# EAGLE schematic robot_board (EAGLE 6.5.0)
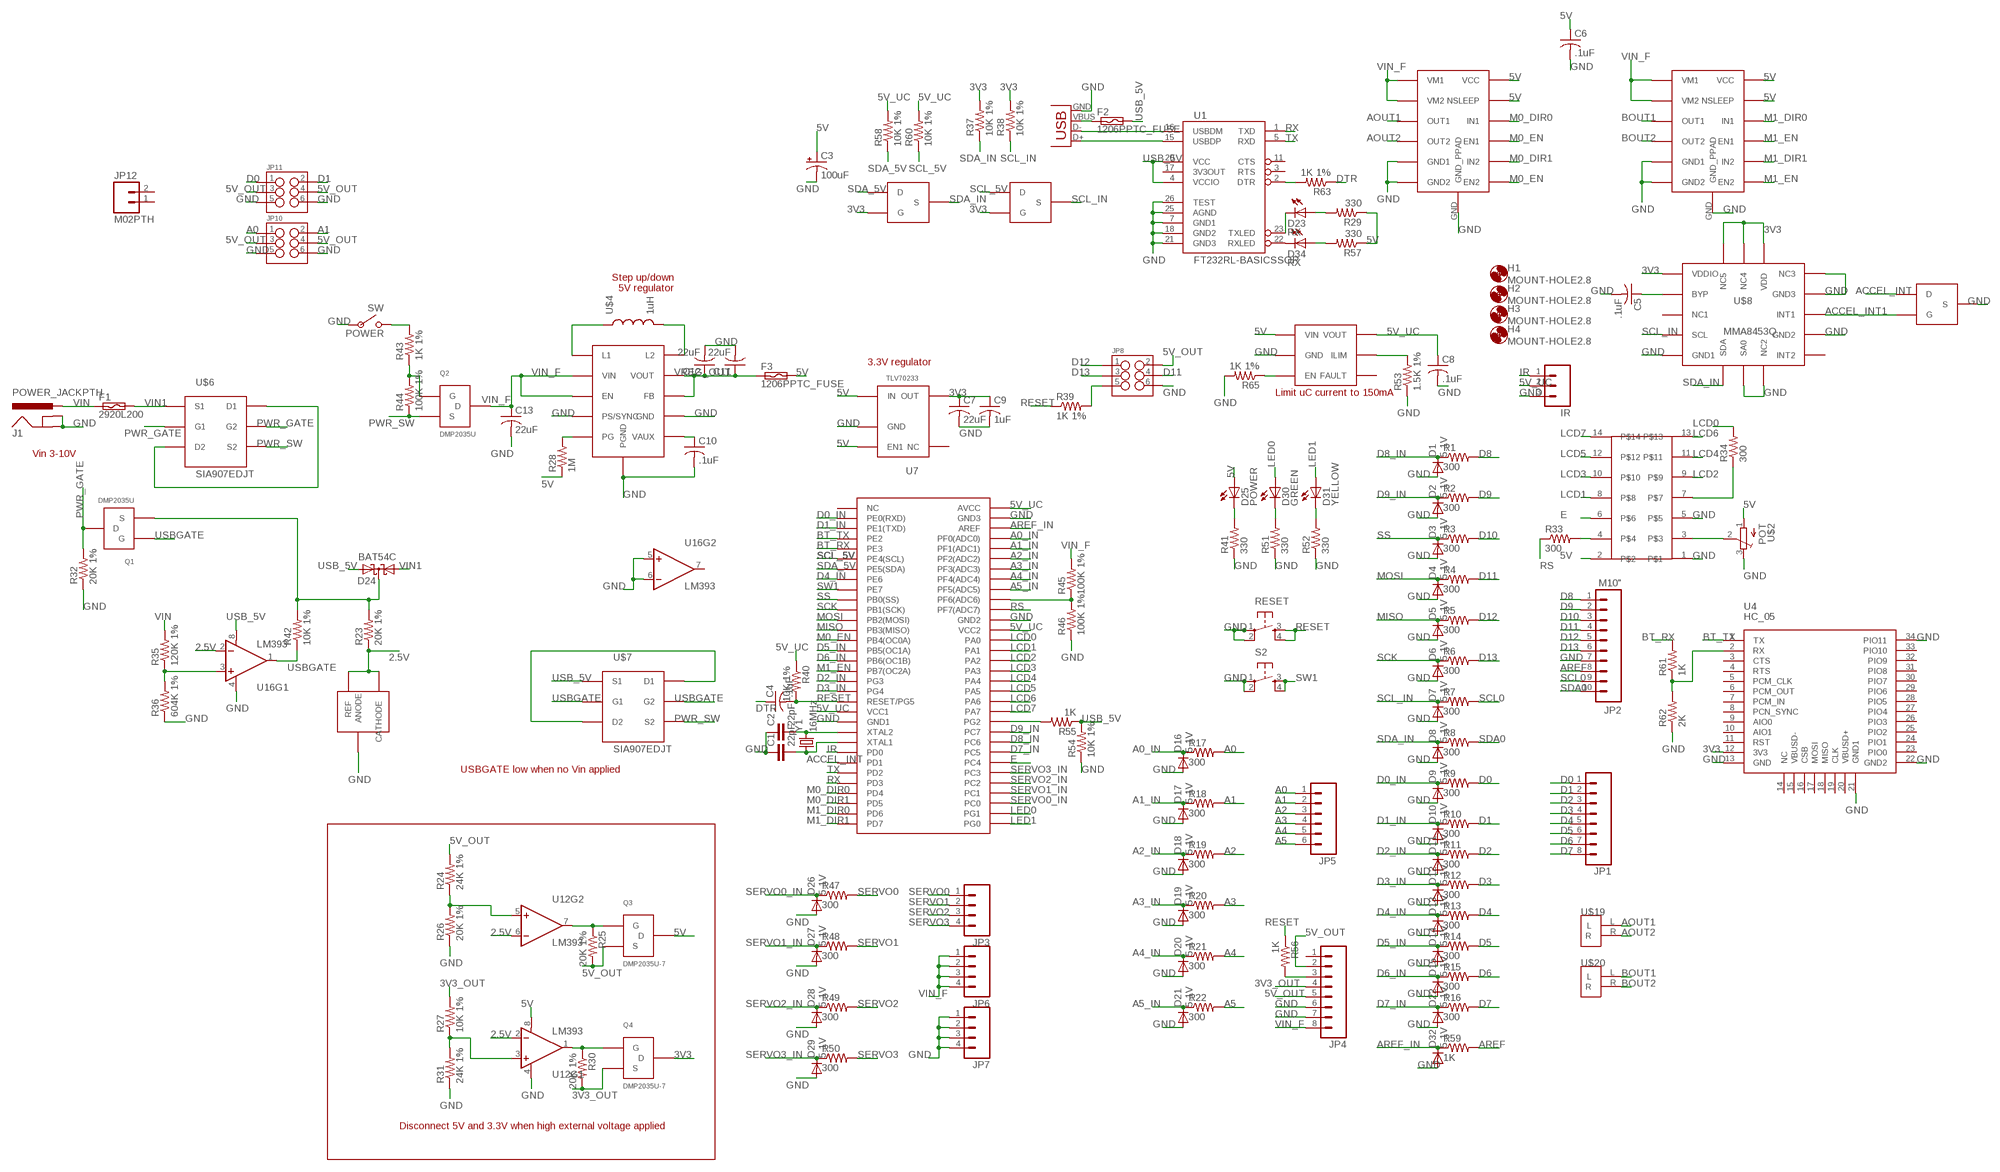
[diagram p0: schematic, sheet 1]

## Parts
C1  22pF  CAP0805  [0805]
C2  22pF  CAP0805  [0805]
C3  100uF  CAP_POLD  [PANASONIC_D]
C4  .1uF  C-USC1206  [C1206]
C5  .1uF  C-USC1206  [C1206]
C6  .1uF  C-USC1206  [C1206]
C7  22uF  C-USC1206  [C1206]
C8  .1uF  C-USC1206  [C1206]
C9  1uF  C-USC1206  [C1206]
C10  .1uF  C-USC1206  [C1206]
C11  22uF  C-USC1206  [C1206]
C12  22uF  C-USC1206  [C1206]
C13  22uF  C-USC1206  [C1206]
D1  5.1V  DIODESOT23  [SOT23-3]
D2  5.1V  DIODESOT23  [SOT23-3]
D3  5.1V  DIODESOT23  [SOT23-3]
D4  5.1V  DIODESOT23  [SOT23-3]
D5  5.1V  DIODESOT23  [SOT23-3]
D6  5.1V  DIODESOT23  [SOT23-3]
D7  5.1V  DIODESOT23  [SOT23-3]
D8  5.1V  DIODESOT23  [SOT23-3]
D9  5.1V  DIODESOT23  [SOT23-3]
D10  5.1V  DIODESOT23  [SOT23-3]
D11  5.1V  DIODESOT23  [SOT23-3]
D12  5.1V  DIODESOT23  [SOT23-3]
D13  5.1V  DIODESOT23  [SOT23-3]
D14  5.1V  DIODESOT23  [SOT23-3]
D15  5.1V  DIODESOT23  [SOT23-3]
D16  5.1V  DIODESOT23  [SOT23-3]
D17  5.1V  DIODESOT23  [SOT23-3]
D18  5.1V  DIODESOT23  [SOT23-3]
D19  5.1V  DIODESOT23  [SOT23-3]
D20  5.1V  DIODESOT23  [SOT23-3]
D21  5.1V  DIODESOT23  [SOT23-3]
D22  5.1V  DIODESOT23  [SOT23-3]
D23  RX  LED-GREENLILYPAD  [LED-1206]
D24  BAT54C  [SOT23]
D25  POWER  LED-GREENLILYPAD  [LED-1206]
D26  5.1V  DIODESOT23  [SOT23-3]
D27  5.1V  DIODESOT23  [SOT23-3]
D28  5.1V  DIODESOT23  [SOT23-3]
D29  5.1V  DIODESOT23  [SOT23-3]
D30  GREEN  LED-GREENLILYPAD  [LED-1206]
D31  YELLOW  LED-GREENLILYPAD  [LED-1206]
D32  5.1V  DIODESOT23  [SOT23-3]
D34  RX  LED-GREENLILYPAD  [LED-1206]
F1  2920L200  [SMD050F]
F2  1206PPTC_FUSE  [R1206]
F3  1206PPTC_FUSE  [R1206]
H1  MOUNT-HOLE2.8  [2,8]
H2  MOUNT-HOLE2.8  [2,8]
H3  MOUNT-HOLE2.8  [2,8]
H4  MOUNT-HOLE2.8  [2,8]
IR  M03PTH  [1X03]
J1  POWER_JACKPTH  [POWER_JACK_PTH]
JP1  M081X08  [1X08]
JP2  M10"  [1X10]
JP3  M04PTH  [1X04]
JP4  M081X08  [1X08]
JP5  M06SIP  [1X06]
JP6  M04PTH  [1X04]
JP7  M04PTH  [1X04]
JP8  M03X22X3_SILK_SM  [2X3]
JP9  USB-B  USBPTH  [USB-B-PTH]
JP10  M03X22X3_SILK_SM  [2X3]
JP11  M03X22X3_SILK_SM  [2X3]
JP12  M02PTH  [1X02]
POWER  SW  [SW]
Q1  DMP2035U  [SOT23]
Q2  DMP2035U  [SOT23]
Q3  DMP2035U-7  [SOT23@1]
Q4  DMP2035U-7  [SOT23@1]
R1  300  R-US_R1206  [R1206]
R2  300  R-US_R1206  [R1206]
R3  300  R-US_R1206  [R1206]
R4  300  R-US_R1206  [R1206]
R5  300  R-US_R1206  [R1206]
R6  300  R-US_R1206  [R1206]
R7  300  R-US_R1206  [R1206]
R8  300  R-US_R1206  [R1206]
R9  300  R-US_R1206  [R1206]
R10  300  R-US_R1206  [R1206]
R11  300  R-US_R1206  [R1206]
R12  300  R-US_R1206  [R1206]
R13  300  R-US_R1206  [R1206]
R14  300  R-US_R1206  [R1206]
R15  300  R-US_R1206  [R1206]
R16  300  R-US_R1206  [R1206]
R17  300  R-US_R1206  [R1206]
R18  300  R-US_R1206  [R1206]
R19  300  R-US_R1206  [R1206]
R20  300  R-US_R1206  [R1206]
R21  300  R-US_R1206  [R1206]
R22  300  R-US_R1206  [R1206]
R23  20K 1%  R-US_R1206  [R1206]
R24  24K 1%  R-US_R1206  [R1206]
R25  20K 1%  R-US_R1206  [R1206]
R26  20K 1%  R-US_R1206  [R1206]
R27  10K 1%  R-US_R1206  [R1206]
R28  1M  R-US_R1206  [R1206]
R29  330  R-US_R1206  [R1206]
R30  20K 1%  R-US_R1206  [R1206]
R31  24K 1%  R-US_R1206  [R1206]
R32  20K 1%  R-US_R1206  [R1206]
R33  300  R-US_R1206  [R1206]
R34  300  R-US_R1206  [R1206]
R35  120K 1%  R-US_R1206  [R1206]
R36  604K 1%  R-US_R1206  [R1206]
R37  10K 1%  R-US_R1206  [R1206]
R38  10K 1%  R-US_R1206  [R1206]
R39  1K 1%  R-US_R1206  [R1206]
R40  10K 1%  R-US_R1206  [R1206]
R41  330  R-US_R1206  [R1206]
R42  10K 1%  R-US_R1206  [R1206]
R43  1K 1%  R-US_R1206  [R1206]
R44  100K 1%  R-US_R1206  [R1206]
R45  100K 1%  R-US_R1206  [R1206]
R46  100K 1%  R-US_R1206  [R1206]
R47  300  R-US_R1206  [R1206]
R48  300  R-US_R1206  [R1206]
R49  300  R-US_R1206  [R1206]
R50  300  R-US_R1206  [R1206]
R51  330  R-US_R1206  [R1206]
R52  330  R-US_R1206  [R1206]
R53  1.5K 1%  R-US_R1206  [R1206]
R54  10K 1%  R-US_R1206  [R1206]
R55  1K  R-US_R1206  [R1206]
R56  1K  R-US_R1206  [R1206]
R57  330  R-US_R1206  [R1206]
R58  10K 1%  R-US_R1206  [R1206]
R59  1K  R-US_R1206  [R1206]
R60  10K 1%  R-US_R1206  [R1206]
R61  1K  R-US_R1206  [R1206]
R62  2K  R-US_R1206  [R1206]
R63  1K 1%  R-US_R1206  [R1206]
R65  1K 1%  R-US_R1206  [R1206]
RESET  TAC_SWITCHPTH  [TACTILE-PTH]
S2  TAC_SWITCHPTH  [TACTILE-PTH]
U1  FT232RL-BASICSSOP  [SSOP28DB]
U4  HC_05  [BLUETOOTH_SMD]
U7  TLV70233  [SOT-23-5]
U8  MIC2009A  [SOT23-M5]
U9  DRV8839  [PWSON-N12]
U10  DRV8839  [PWSON-N12]
U12  LM393  [SO08]
U16  LM393  [SO08]
U17  ATMEGA325PA  [TQFP64]
U$1  2X7HEADER  [2X7]
U$2  POT  [POT]
U$3  TPS63061  [WSON-10]
U$4  1uH  TAIYO4012  [TAIYO4012]
U$5  AP431SAG-7  [SOT23]
U$6  SIA907EDJT  [SC70T]
U$7  SIA907EDJT  [SC70T]
U$8  MMA8453Q  [QFN-COL]
U$9  BSS138  [SOT23]
U$10  BSS138  [SOT23]
U$11  BSS138  [SOT23]
U$19  2POS_TERMINAL  [2POS_TERMINAL]
U$20  2POS_TERMINAL  [2POS_TERMINAL]
Y1  16MHz  CRYSTAL10.5X4.8  [CRYSTAL-SMD-10.5X4.8-2PIN]

## Nets
2.5V: R23.1 U12.2(-IN) U12.6(-IN) U16.2(-IN) U$5.1(CATHODE) U$5.2(REF)
3V3: C7.1 C9.1 Q4.3(D) R37.2 R38.2 U4.12(3V3) U7.P$4(OUT) U$8.P$1(VDDIO) U$8.P$14(VDD) U$8.P$15(NC4) U$8.P$16(NC5) U$9.1(G) U$10.1(G)
3V3_OUT: JP4.4 Q4.2(S) R27.2 R30.2
5V: C3.+ C6.1 D25.A F3.2 Q3.3(D) R28.1 R29.1 R57.1 U7.P$1(IN) U7.P$3(EN1) U8.P$1(VIN) U9.P$7(VCC) U9.P$8(NSLEEP) U10.P$7(VCC) U10.P$8(NSLEEP) U12.8(V+) U$1.2 U$2.1(A)
5V_OUT: JP4.2 JP4.5 JP8.2 JP10.3 JP10.4 JP11.3 JP11.4 Q3.2(S) R24.2 R25.2
5V_UC: C8.1 IR.2 R40.1 R58.2 R60.2 U8.P$6(VOUT) U17.21(VCC1) U17.52(VCC2) U17.64(AVCC)
A0: JP5.1 JP10.1 R17.2
A0_IN: D16.3(C) R17.1 U17.61(PF0(ADC0))
A1: JP5.2 JP10.2 R18.2
A1_IN: D17.3(C) R18.1 U17.60(PF1(ADC1))
A2: JP5.3 R19.2
A2_IN: D18.3(C) R19.1 U17.59(PF2(ADC2))
A3: JP5.4 R20.2
A3_IN: D19.3(C) R20.1 U17.58(PF3(ADC3))
A4: JP5.5 R21.2
A4_IN: D20.3(C) R21.1 U17.57(PF4(ADC4))
A5: JP5.6 R22.2
A5_IN: D21.3(C) R22.1 U17.56(PF5(ADC5))
ACCEL_INT: U17.26(PD1) U$11.3(D)
ACCEL_INT1: U$8.P$11(INT1) U$11.1(G)
AOUT1: U9.P$3(OUT1) U$19.L
AOUT2: U9.P$4(OUT2) U$19.R
AREF: JP2.8 R59.2
AREF_IN: D32.3(C) R59.1 U17.62(AREF)
BOUT1: U10.P$3(OUT1) U$20.L
BOUT2: U10.P$4(OUT2) U$20.R
BT_RX: R61.2 U17.5(PE3)
BT_TX: U4.1(TX) U17.4(PE2)
D0: JP1.1 JP11.1 R9.2
D0_IN: D9.3(C) R9.1 U17.2(PE0(RXD))
D1: JP1.2 JP11.2 R10.2
D1_IN: D10.3(C) R10.1 U17.3(PE1(TXD))
D2: JP1.3 R11.2
D2_IN: D11.3(C) R11.1 U17.18(PG3)
D3: JP1.4 R12.2
D3_IN: D12.3(C) R12.1 U17.19(PG4)
D4: JP1.5 R13.2
D4_IN: D13.3(C) R13.1 U17.8(PE6)
D5: JP1.6 R14.2
D5_IN: D14.3(C) R14.1 U17.15(PB5(OC1A))
D6: JP1.7 R15.2
D6_IN: D15.3(C) R15.1 U17.16(PB6(OC1B))
D7: JP1.8 R16.2
D7_IN: D22.3(C) R16.1 U17.40(PC5)
D8: JP2.1 R1.2
D8_IN: D1.3(C) R1.1 U17.41(PC6)
D9: JP2.2 R2.2
D9_IN: D2.3(C) R2.1 U17.42(PC7)
D10: JP2.3 R3.2
D11: JP2.4 JP8.4 R4.2
D12: JP2.5 JP8.1 R5.2
D13: JP2.6 JP8.3 R6.2
DTR: C4.1 R63.1
E: U17.39(PC4) U$1.6
GND: C1.1 C2.1 C3.- C5.2 C6.2 C7.2 C8.2 C9.2 C10.2 C11.2 C12.2 C13.2 D1.1(A) D2.1(A) D3.1(A) D4.1(A) D5.1(A) D6.1(A) D7.1(A) D8.1(A) D9.1(A) D10.1(A) D11.1(A) D12.1(A) D13.1(A) D14.1(A) D15.1(A) D16.1(A) D17.1(A) D18.1(A) D19.1(A) D20.1(A) D21.1(A) D22.1(A) D26.1(A) D27.1(A) D28.1(A) D29.1(A) D32.1(A) IR.3 J1.GND J1.GNDBREAK JP2.7 JP4.6 JP4.7 JP7.1 JP7.2 JP7.3 JP7.4 JP8.6 JP9.GND JP10.5 JP10.6 JP11.5 JP11.6 POWER.P$2 R26.1 R31.1 R32.1 R36.1 R41.1 R46.1 R51.1 R52.1 R53.1 R54.1 R62.1 R65.2 RESET.1 RESET.2 S2.1 S2.2 U1.7(GND1) U1.18(GND2) U1.21(GND3) U1.25(AGND) U1.26(TEST) U4.13(GND) U4.21(GND1) U4.22(GND2) U4.34(PIO11) U7.P$2(GND) U8.P$2(GND) U9.GND(GND_PPAD) U9.P$5(GND1) U9.P$6(GND2) U10.GND(GND_PPAD) U10.P$5(GND1) U10.P$6(GND2) U12.4(V-) U16.4(V-) U16.5(+IN) U16.6(-IN) U17.22(GND1) U17.53(GND2) U17.63(GND3) U$1.1 U$1.5 U$2.3(E) U$3.GND@N1(PGND) U$3.GND@N2(PGND) U$3.GND@N3(PGND) U$3.GND@N4(PGND) U$3.GND@N5(PGND) U$3.GND@N6(PGND) U$3.GND@N7(PGND) U$3.GND@N8(PGND) U$3.P$4(PS/SYNC) U$3.P$7(GND) U$3.P$11(PGND) U$5.3(ANODE) U$8.P$5(GND1) U$8.P$7(SA0) U$8.P$8(NC2) U$8.P$10(GND2) U$8.P$12(GND3) U$8.P$13(NC3) U$11.2(S)
IR: IR.1 U17.25(PD0)
LCD0: R34.2 U17.51(PA0)
LCD1: U17.50(PA1) U$1.8
LCD2: U17.49(PA2) U$1.9
LCD3: U17.48(PA3) U$1.10
LCD4: U17.47(PA4) U$1.11
LCD5: U17.46(PA5) U$1.12
LCD6: U17.45(PA6) U$1.13
LCD7: U17.44(PA7) U$1.14
LED0: D30.A U17.34(PG1)
LED1: D31.A U17.33(PG0)
M0_DIR0: U9.P$9(IN1) U17.29(PD4)
M0_DIR1: U9.P$11(IN2) U17.30(PD5)
M0_EN: U9.P$10(EN1) U9.P$12(EN2) U17.14(PB4(OC0A))
M1_DIR0: U10.P$9(IN1) U17.31(PD6)
M1_DIR1: U10.P$11(IN2) U17.32(PD7)
M1_EN: U10.P$10(EN1) U10.P$12(EN2) U17.17(PB7(OC2A))
MISO: D5.3(C) R5.1 U17.13(PB3(MISO))
MOSI: D4.3(C) R4.1 U17.12(PB2(MOSI))
N$1: JP9.D- U1.16(USBDM)
N$2: JP9.D+ U1.15(USBDP)
N$3: C2.2 U17.23(XTAL2) Y1.P$2
N$4: C1.2 U17.24(XTAL1) Y1.P$1
N$5: R53.2 U8.P$5(ILIM)
N$6: R55.2 U17.43(PG2)
N$7: JP4.3 R56.2
N$8: C5.1 U$8.P$2(BYP)
N$9: F2.1 JP9.VBUS
N$10: D34.C U1.22(RXLED)
N$11: D34.A R57.2
N$12: D23.A R29.2
N$13: R61.1 R62.2 U4.2(RX)
N$14: R63.2 U1.2(DTR)
N$15: U$1.3 U$2.2(S)
N$16: R28.2 U$3.P$5(PG)
N$17: R65.1 U8.P$3(EN)
N$18: D24.3(CC) Q1.2(S) R23.2 R42.2
N$19: C10.1 U$3.P$6(VAUX)
N$20: U$3.P$1(L1) U$4.P$1
N$21: U$3.P$10(L2) U$4.P$2
N$22: D23.C U1.23(TXLED)
N$23: U$7.D1@1(D1) U$7.D1@2(D1) U$7.D2@1(D2) U$7.D2@2(D2)
N$24: U$6.D1@1(D1) U$6.D1@2(D1) U$6.D2@1(D2) U$6.D2@2(D2)
N$25: R33.2 U$1.4
N$26: R34.1 U$1.7
N$30: Q3.1(G) R25.1 U12.7(OUT)
N$34: R24.1 R26.2 U12.5(+IN)
N$38: R27.1 R31.2 U12.3(+IN)
N$39: R35.1 R36.2 U16.3(+IN)
N$41: D25.C R41.2
N$43: POWER.P$1 R43.2
N$45: Q4.1(G) R30.1 U12.1(OUT)
N$46: JP8.5 R39.2
N$51: Q2.1(G) R43.1 R44.2
N$52: R45.1 R46.2 U17.55(PF6(ADC6))
N$57: D30.C R51.2
N$62: D31.C R52.2
PWR_GATE: Q1.3(D) R32.2 U$6.G1 U$6.G2
PWR_SW: Q2.2(S) R44.1 U$6.S2 U$7.S2
RESET: C4.2 R39.1 R40.2 R56.1 RESET.3 RESET.4 U17.20(RESET/PG5)
RS: R33.1 U17.54(PF7(ADC7))
RX: U1.1(TXD) U17.28(PD3)
SCK: D6.3(C) R6.1 U17.11(PB1(SCK))
SCL0: JP2.9 R7.2
SCL_5V: R60.1 U17.6(PE4(SCL)) U$10.3(D)
SCL_IN: D7.3(C) R7.1 R38.1 U$8.P$4(SCL) U$10.2(S)
SDA0: JP2.10 R8.2
SDA_5V: R58.1 U17.7(PE5(SDA)) U$9.3(D)
SDA_IN: D8.3(C) R8.1 R37.1 U$8.P$6(SDA) U$9.2(S)
SERVO0: JP3.1 R47.2
SERVO0_IN: D26.3(C) R47.1 U17.35(PC0)
SERVO1: JP3.2 R48.2
SERVO1_IN: D27.3(C) R48.1 U17.36(PC1)
SERVO2: JP3.3 R49.2
SERVO2_IN: D28.3(C) R49.1 U17.37(PC2)
SERVO3: JP3.4 R50.2
SERVO3_IN: D29.3(C) R50.1 U17.38(PC3)
SS: D3.3(C) R3.1 U17.10(PB0(SS))
SW1: S2.3 S2.4 U17.9(PE7)
TX: U1.5(RXD) U17.27(PD2)
USB_5V: D24.2(A2) F2.2 R54.2 R55.1 U1.4(VCCIO) U1.20(VCC) U16.8(V+) U$7.S1
USBGATE: Q1.1(G) R42.1 U16.1(OUT) U$7.G1 U$7.G2
VIN: F1.1 J1.PWR R35.2
VIN1: D24.1(A1) F1.2 U$6.S1
VIN_F: C13.1 JP4.8 JP6.1 JP6.2 JP6.3 JP6.4 Q2.3(D) R45.2 U9.P$1(VM1) U9.P$2(VM2) U10.P$1(VM1) U10.P$2(VM2) U$3.P$2(VIN) U$3.P$3(EN)
VREG_OUT: C11.1 C12.1 F3.1 U$3.P$8(FB) U$3.P$9(VOUT)
Unconnected: JP4.1 JP12.1 JP12.2 U1.3(RTS) U1.11(CTS) U1.17(3V3OUT) U4.3(CTS) U4.4(RTS) U4.5(PCM_CLK) U4.6(PCM_OUT) U4.7(PCM_IN) U4.8(PCN_SYNC) U4.9(AIO0) U4.10(AIO1) U4.11(RST) U4.14(NC) U4.15(VBUSD-) U4.16(CSB) U4.17(MOSI) U4.18(MISO) U4.19(CLK) U4.20(VBUSD+) U4.23(PIO0) U4.24(PIO1) U4.25(PIO2) U4.26(PIO3) U4.27(PIO4) U4.28(PIO5) U4.29(PIO6) U4.30(PIO7) U4.31(PIO8) U4.32(PIO9) U4.33(PIO10) U7.P$5(NC) U8.P$4(FAULT) U16.7(OUT) U17.1(NC) U$8.P$3(NC1) U$8.P$9(INT2)

## Notes on the sheet
- Step up/down
  5V regulator
- 3.3V regulator
- Limit uC current to 150mA
- Vin 3-10V
- USBGATE low when no Vin applied
- Disconnect 5V and 3.3V when high external voltage applied

## Library data of the parts
C1 C2 = SparkFun-Passives:CAP: Capacitor Standard 0603 ceramic capacitor, and 0.1" leaded capacitor.
C3 = SparkFun-Capacitors:CAP_POL: Capacitor Polarized These are standard SMD and PTH capacitors. Normally 10uF, 47uF, and 100uF in electrolytic and tantalum varieties. Always verify the external diameter of the through hole cap, it varies with capacity, voltage, and manufacturer. The EIA devices should be standard.
C4-C13 = resistor:C-US: CAPACITOR, American symbol
D1-D22 D26-D29 D32 = SparkFun-DiscreteSemi:DIODE: Diode These are standard reverse protection diodes and small signal diodes. SMA package can handle up to about 1A. SOD-323 can handle about 200mA. What the SOD-323 package when ordering, there are some mfgs out there that are 5-pin packages.
D23 D25 D31 D34 = SparkFun-LED:LED-GREEN: Various green LEDs 0603- DIO-00821 LARGE- DIO-00862 LILYPAD- DIO-09910; PROD_ID: DIO-09910; VALUE: GREEN
D24 = diode:BAT54C: Schottky Diodes Source: Fairchild .. BAT54.pdf
D30 = SparkFun-LED:LED-GREEN: Various green LEDs 0603- DIO-00821 LARGE- DIO-00862 LILYPAD- DIO-09910; PROD_ID: DIO-09910
F1 = jseng:2920L200: PolySwitch (TM) Resettable Device Source: Data sheet <http://www.farnell.com/datasheets/13482.pdf>
F2 F3 = jseng:1206PPTC_FUSE
H1-H4 = holes:MOUNT-HOLE: MOUNTING HOLE with drill center marker
IR = SparkFun-Connectors:M03: Header 3 Standard 3-pin 0.1" header. Use with straight break away headers (SKU : PRT-00116), right angle break away headers (PRT-00553), swiss pins (PRT-00743), machine pins (PRT-00117), and female headers (PRT-00115). Molex polarized connector foot print use with SKU : PRT-08232 with associated crimp pins and housings.
J1 = SparkFun-Connectors:POWER_JACK: Power Jack This is the standard 5.5mm barrel jack for power. The PTH is the most common, proven, reliable, footprint. The Slot footprint only works if the mill layer is transmitted to the PCB fab house so be warned. Mating wall wart : TOL-00298 (and others); PROD_ID: PRT-00119
JP1 JP4 = SparkFun-Connectors:M08: Header 8 Standard 8-pin 0.1" header. Use with straight break away headers (SKU : PRT-00116), right angle break away headers (PRT-00553), swiss pins (PRT-00743), machine pins (PRT-00117), and female headers (PRT-00115).
JP2 = SparkFun-Connectors:M10: Header 10 Standard 10-pin 0.1" header. Use with straight break away headers (SKU : PRT-00116), right angle break away headers (PRT-00553), swiss pins (PRT-00743), machine pins (PRT-00117), and female headers (PRT-00115).
JP3 JP6 JP7 = SparkFun-Connectors:M04: Header 4 Standard 4-pin 0.1" header. Use with straight break away headers (SKU : PRT-00116), right angle break away headers (PRT-00553), swiss pins (PRT-00743), machine pins (PRT-00117), and female headers (PRT-00115). Molex polarized connector foot print use with SKU : PRT-08231 with associated crimp pins and housings. 1MM SMD Version SKU: PRT-10208
JP5 = SparkFun-Connectors:M06: Header 6 Standard 6-pin 0.1" header. Use with straight break away headers (SKU : PRT-00116), right angle break away headers (PRT-00553), swiss pins (PRT-00743), machine pins (PRT-00117), and female headers (PRT-00115). Molex polarized connector foot print use with SKU : PRT-08094 with associated crimp pins and housings. NOTES ON THE VARIANTS LOCK and LOCK_LONGPADS... This footprint was designed to help hold the alignment of a through-hole component (i.e. 6-pin header) while soldering it into place. You may notice that each hole has been shifted either up or down by 0.005 of an inch from it's more standard position (which is a perfectly straight line). This slight alteration caused the pins (the squares in the middle) to touch the edges of the holes. Because they are alternating, it causes a "brace" to hold the component in place. 0.005 has proven to be the perfect amount of "off-center" position when using our standard breakaway headers. Although looks a little odd when you look at the bare footprint, once you have a header in there, the alteration is very hard to notice. Also,if you push a header all the way into place, it is covered up entirely on the bottom side. This idea of altering the position of holes to aid alignment will be further integrated into the Sparkfun Library for other footprints. It can help hold any component with 3 or more connection pins.
JP8 JP10 JP11 = SparkFun-Connectors:M03X2: 2x3 .1" header. Shrouded, with keying- CONN-10681 SMT- CONN-11415 Pogo pins- HW-11044
JP9 = SparkFun-Connectors:USB: USB Connectors USB-B-PTH is fully proven SKU : PRT-00139/CONN-08278 USB-miniB is fully proven SKU : PRT-00587 USB-A-PCB is untested. USB-A-H is throughly reviewed, but untested. Spark Fun Electronics SKU : PRT-00437 USB-B-SMT is throughly reviewed, but untested. Needs silkscreen touching up. USB-A-S has not been used/tested USB-MB-H has not been used/tested USB-MICROB has been used. CONN-09505; PROD_ID: CONN-08278
JP12 = SparkFun-Connectors:M02: Standard 2-pin 0.1" header. Use with - straight break away headers ( PRT-00116) - right angle break away headers (PRT-00553) - swiss pins (PRT-00743) - machine pins (PRT-00117) - female headers (PRT-00115) Molex polarized connector foot print use with: PRT-08233 with associated crimp pins and housings. 2.54_SCREWTERM for use with PRT-10571. 3.5mm Screw Terminal footprints for PRT-08084 5mm Screw Terminal footprints for use with PRT-08433
POWER = r_cubed:SW
Q1 Q2 = jseng:DMP2035U: Diodes Inc. DMP2035U-7 P-channel logic level mosfet
Q3 Q4 = jseng:DMP2035U-7: Diodes Inc. DMP2035U-7 P-channel logic level mosfet
R1-R63 R65 = resistor:R-US_: RESISTOR, American symbol
RESET S2 = SparkFun-Electromechanical:TAC_SWITCH: Momentary Switch Button commonly used for reset or general input. Spark Fun Electronics SKU : COM-00097 SMT- SWCH-08247
U1 = SparkFun-DigitalIC:FT232RL-BASIC: USB UART This is the simplified version of the FT232RL unit. Only what you need, nothing you don't. Spark Fun Electronics SKU : COM-00650
U4 = SerialPortBluetooth:HC_05
U7 = jseng:TLV70233: TLV70233 - 3.3V 350mA regulator
U8 = jseng:MIC2009A
U9 U10 = jseng:DRV8839
U12 U16 = SparkFun-AnalogIC:LM393: Low-voltage comparator
U17 = jseng:ATMEGA325PA
U$1 = jseng:2X7HEADER
U$2 = r_cubed:POT
U$3 = jseng:TPS63061: TPS63031 - Step up/down 5V regulator
U$4 = jseng:TAIYO4012
U$5 = jseng:AP431SAG-7
U$6 U$7 = jseng:SIA907EDJT
U$8 = jseng:MMA8453Q
U$9-U$11 = jseng:BSS138
U$19 U$20 = r_cubed:2POS_TERMINAL
Y1 = SparkFun-FreqCtrl:CRYSTAL: Various standard crystals. Proven footprints. Spark Fun Electronics SKU : COM-00534